# EAGLE schematic WiLoV2 (EAGLE 9.6.2)

## Sheet 1 of 3
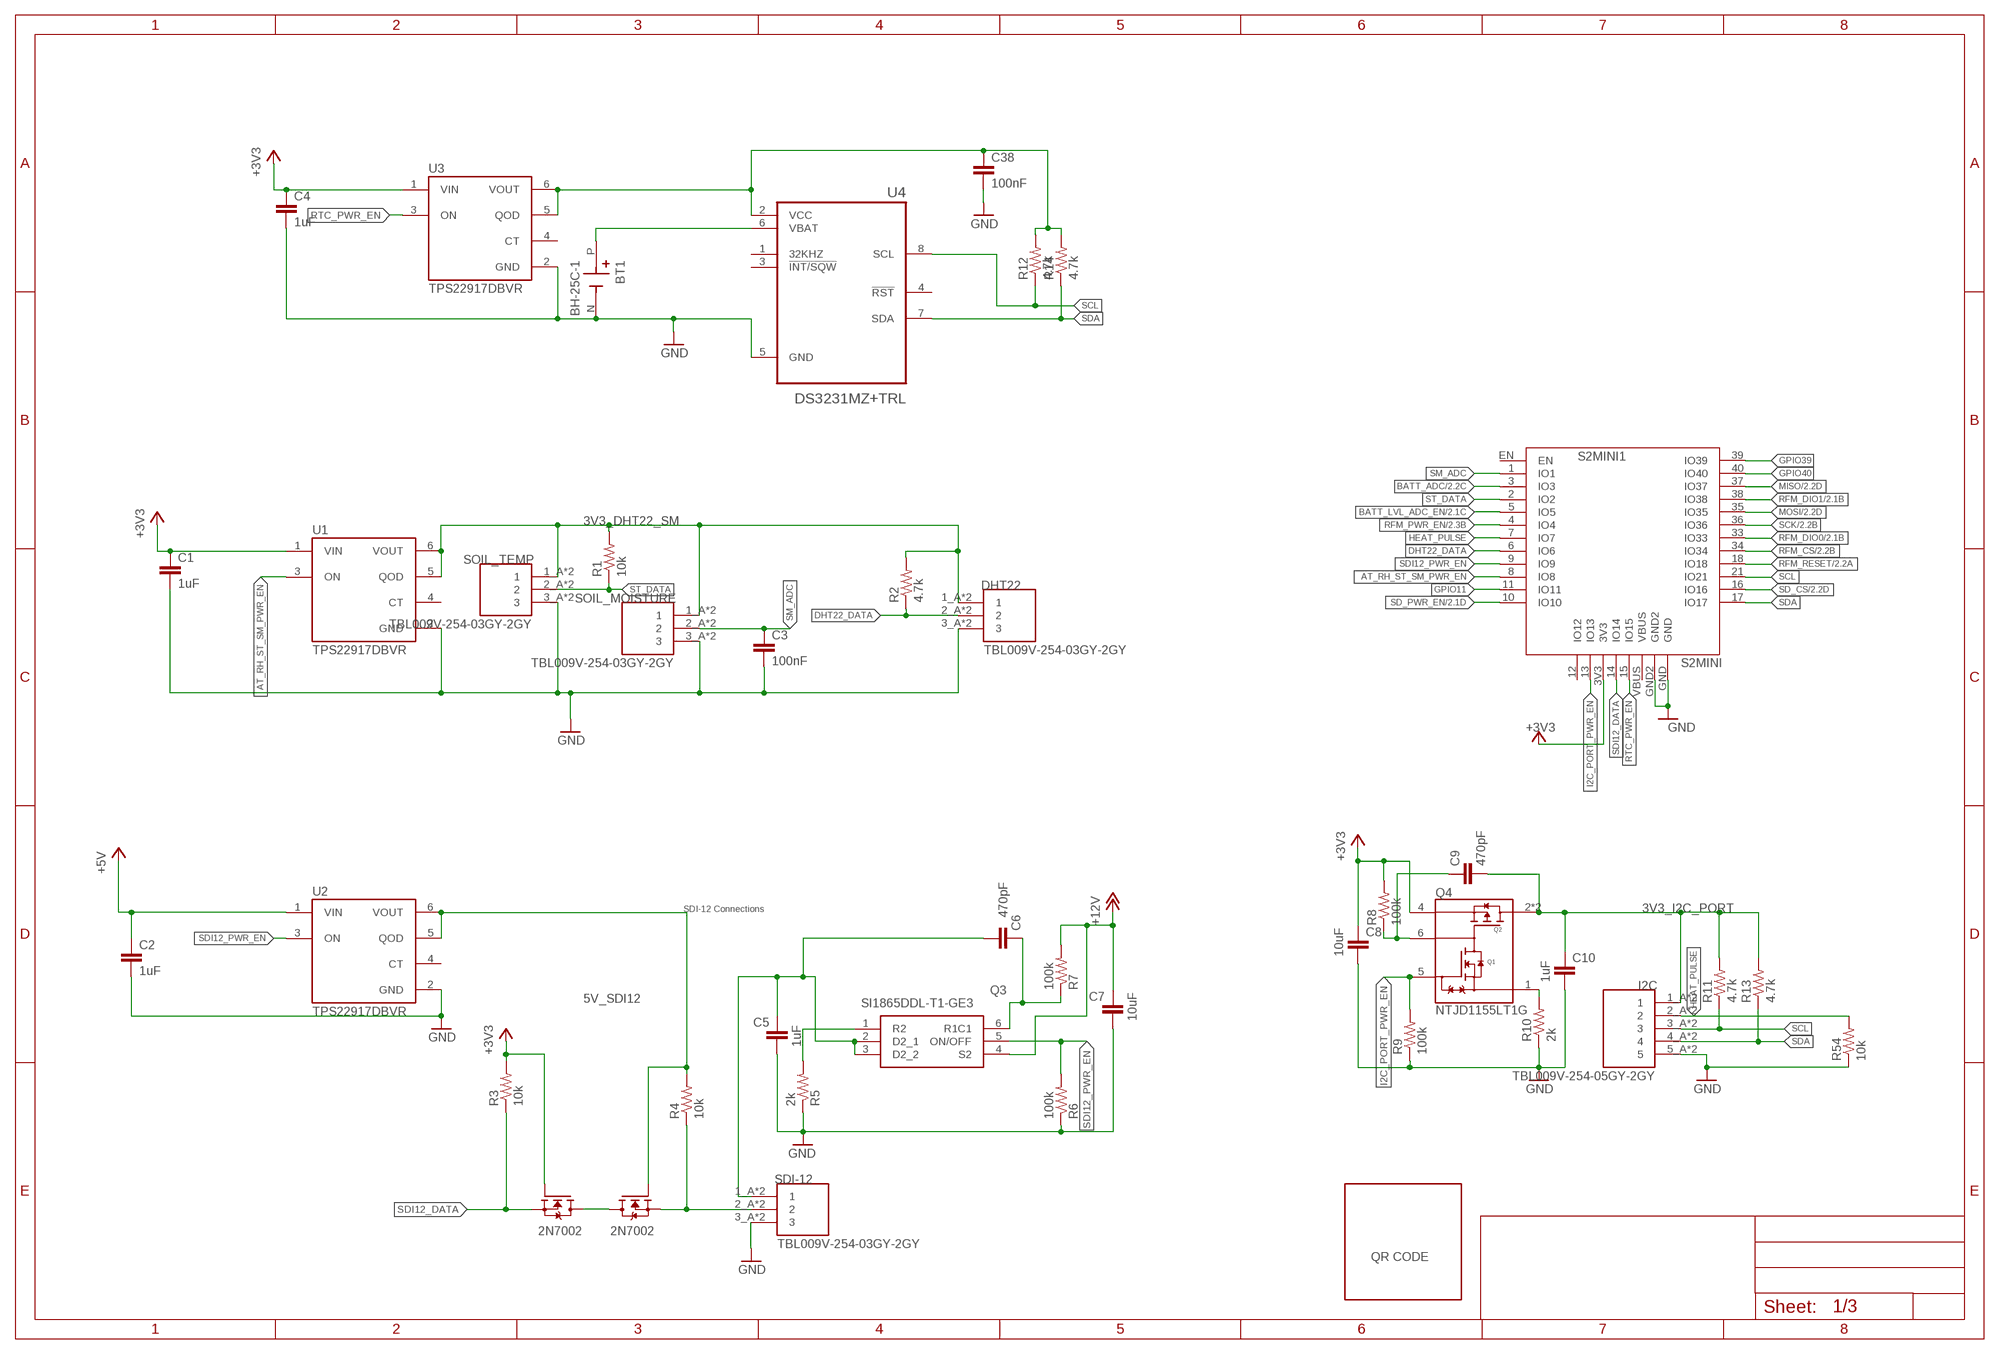
[diagram p0: schematic, sheet 1]

### Parts
BT1  BH-25C-1  [BAT_BH-25C-1]
C1  1uF  C-EUC0805  [C0805]
C2  1uF  C-EUC0805  [C0805]
C3  100nF  C-EUC0805  [C0805]
C4  1uF  C-EUC0805  [C0805]
C5  1uF  C-EUC0805  [C0805]
C6  470pF  C-EUC0805  [C0805]
C7  10uF  C-EUC0805  [C0805]
C8  10uF  C-EUC0805  [C0805]
C9  470pF  C-EUC0805  [C0805]
C10  1uF  C-EUC0805  [C0805]
C38  100nF  C-EUC0805  [C0805]
DHT22  TBL009V-254-03GY-2GY  [CUI_TBL009V-254-03GY-2GY]
I2C  TBL009V-254-05GY-2GY  [CUI_TBL009V-254-05GY-2GY]
Q1  2N7002  [SOT95P240X111-3N]
Q2  2N7002  [SOT95P240X111-3N]
Q3  SI1865DDL-T1-GE3  [SOT65P210X110-6N]
Q4  NTJD1155LT1G  [TRANS_NTJD1155LT1G]
QR_CODE  QR_CODE  [QR_CODE]
R1  10k  R-US_R0603  [R0603]
R2  4.7k  R-US_R0603  [R0603]
R3  10k  R-US_R0603  [R0603]
R4  10k  R-US_R0603  [R0603]
R5  2k  R-US_R0603  [R0603]
R6  100k  R-US_R0603  [R0603]
R7  100k  R-US_R0603  [R0603]
R8  100k  R-US_R0603  [R0603]
R9  100k  R-US_R0603  [R0603]
R10  2k  R-US_R0603  [R0603]
R11  4.7k  R-US_R0603  [R0603]
R12  4.7k  R-US_R0603  [R0603]
R13  4.7k  R-US_R0603  [R0603]
R14  4.7k  R-US_R0603  [R0603]
R54  10k  R-US_R0603  [R0603]
S2MINI1  S2MINI  [S2MINI]
SDI-12  TBL009V-254-03GY-2GY  [CUI_TBL009V-254-03GY-2GY]
SOIL_MOISTURE  TBL009V-254-03GY-2GY  [CUI_TBL009V-254-03GY-2GY]
SOIL_TEMP  TBL009V-254-03GY-2GY  [CUI_TBL009V-254-03GY-2GY]
U1  TPS22917DBVR  [SOT95P280X145-6N]
U2  TPS22917DBVR  [SOT95P280X145-6N]
U3  TPS22917DBVR  [SOT95P280X145-6N]
U4  DS3231MZ+TRL  [SOIC127P600X175-8N]

### Nets
3V3_DHT22_SM: DHT22.1_A DHT22.1_B R1.2 R2.2 SOIL_MOISTURE.1_A SOIL_MOISTURE.1_B SOIL_TEMP.1_A SOIL_TEMP.1_B U1.5(QOD) U1.6(VOUT)
3V3_I2C_PORT: C9.2 C10.1 I2C.1_A I2C.1_B Q4.2(D2) Q4.3(D2) R11.2 R13.2
5V_SDI12: Q2.1(G) R4.2 U2.5(QOD) U2.6(VOUT)
+3V3: C1.1 C4.1 C8.1 Q1.1(G) Q4.4(S2) R3.2 R8.2 S2MINI1.3V3 U1.1(VIN) U3.1(VIN) ; also sheet 2,3
+5V: C2.1 U2.1(VIN) ; also sheet 2
+12V: C7.1 Q3.4(S2) R7.2 ; also sheet 2
AT_RH_ST_SM_PWR_EN [vcc]: S2MINI1.8(IO8) U1.3(ON)
BATT_ADC [vcc]: S2MINI1.3(IO3) ; also sheet 2
BATT_LVL_ADC_EN [vcc]: S2MINI1.5(IO5) ; also sheet 2
DHT22_DATA [vcc]: DHT22.2_A DHT22.2_B R2.1 S2MINI1.6(IO6)
GND: BT1.N C1.2 C2.2 C3.2 C4.2 C5.2 C7.2 C8.2 C10.2 C38.2 DHT22.3_A DHT22.3_B I2C.5_A I2C.5_B R5.1 R6.1 R9.1 R10.1 R54.1 S2MINI1.GND S2MINI1.GND2 SDI-12.3_A SDI-12.3_B SOIL_MOISTURE.3_A SOIL_MOISTURE.3_B SOIL_TEMP.3_A SOIL_TEMP.3_B U1.2(GND) U2.2(GND) U3.2(GND) U4.5(GND) ; also sheet 2,3
GPIO11 [vcc]: S2MINI1.11(IO11)
GPIO39 [vcc]: S2MINI1.39(IO39)
GPIO40: S2MINI1.40(IO40)
HEAT_PULSE: I2C.2_A I2C.2_B R54.2 S2MINI1.7(IO7)
I2C_PORT_PWR_EN [vcc]: Q4.5(G1) R9.2 S2MINI1.13(IO13)
MISO [vcc]: S2MINI1.37(IO37) ; also sheet 2
MOSI [vcc]: S2MINI1.35(IO35) ; also sheet 2
N$1: Q1.3(D) Q2.3(D)
N$2: C6.1 Q3.6(R1C1) R7.1
N$4: Q3.1(R2) R5.2
N$5: C9.1 Q4.6(D1/G2) R8.1
N$7: Q4.1(S1) R10.2
N$8: C5.1 C6.2 Q3.2(D2_1) Q3.3(D2_2) SDI-12.1_A SDI-12.1_B
N$12: BT1.P U4.6(VBAT)
N$14: C38.1 R12.2 R14.2 U3.5(QOD) U3.6(VOUT) U4.2(VCC)
N$24: Q2.2(S) R4.1 SDI-12.2_A SDI-12.2_B
RFM_CS [Impedance]: S2MINI1.34(IO34) ; also sheet 2
RFM_DIO0 [vcc]: S2MINI1.33(IO33) ; also sheet 2
RFM_DIO1: S2MINI1.38(IO38) ; also sheet 2
RFM_PWR_EN [vcc]: S2MINI1.4(IO4) ; also sheet 2
RFM_RESET [vcc]: S2MINI1.18(IO18) ; also sheet 2
RTC_PWR_EN: S2MINI1.15(IO15) U3.3(ON)
SCK [vcc]: S2MINI1.36(IO36) ; also sheet 2
SCL [vcc]: I2C.3_A I2C.3_B R11.1 R12.1 S2MINI1.21(IO21) U4.8(SCL)
SD_CS [vcc]: S2MINI1.16(IO16) ; also sheet 2
SD_PWR_EN [vcc]: S2MINI1.10(IO10) ; also sheet 2
SDA [vcc]: I2C.4_A I2C.4_B R13.1 R14.1 S2MINI1.17(IO17) U4.7(SDA)
SDI12_DATA [vcc]: Q1.2(S) R3.1 S2MINI1.14(IO14)
SDI12_PWR_EN [vcc]: Q3.5(ON/OFF) R6.2 S2MINI1.9(IO9) U2.3(ON)
SM_ADC [vcc]: C3.1 S2MINI1.1(IO1) SOIL_MOISTURE.2_A SOIL_MOISTURE.2_B
ST_DATA [vcc]: R1.1 S2MINI1.2(IO2) SOIL_TEMP.2_A SOIL_TEMP.2_B
Unconnected: S2MINI1.12(IO12) S2MINI1.EN S2MINI1.VBUS U1.4(CT) U2.4(CT) U3.4(CT) U4.1(32KHZ) U4.3(!INT/SQW) U4.4(!RST)

### Notes on the sheet
- SDI-12 Connections

## Sheet 2 of 3
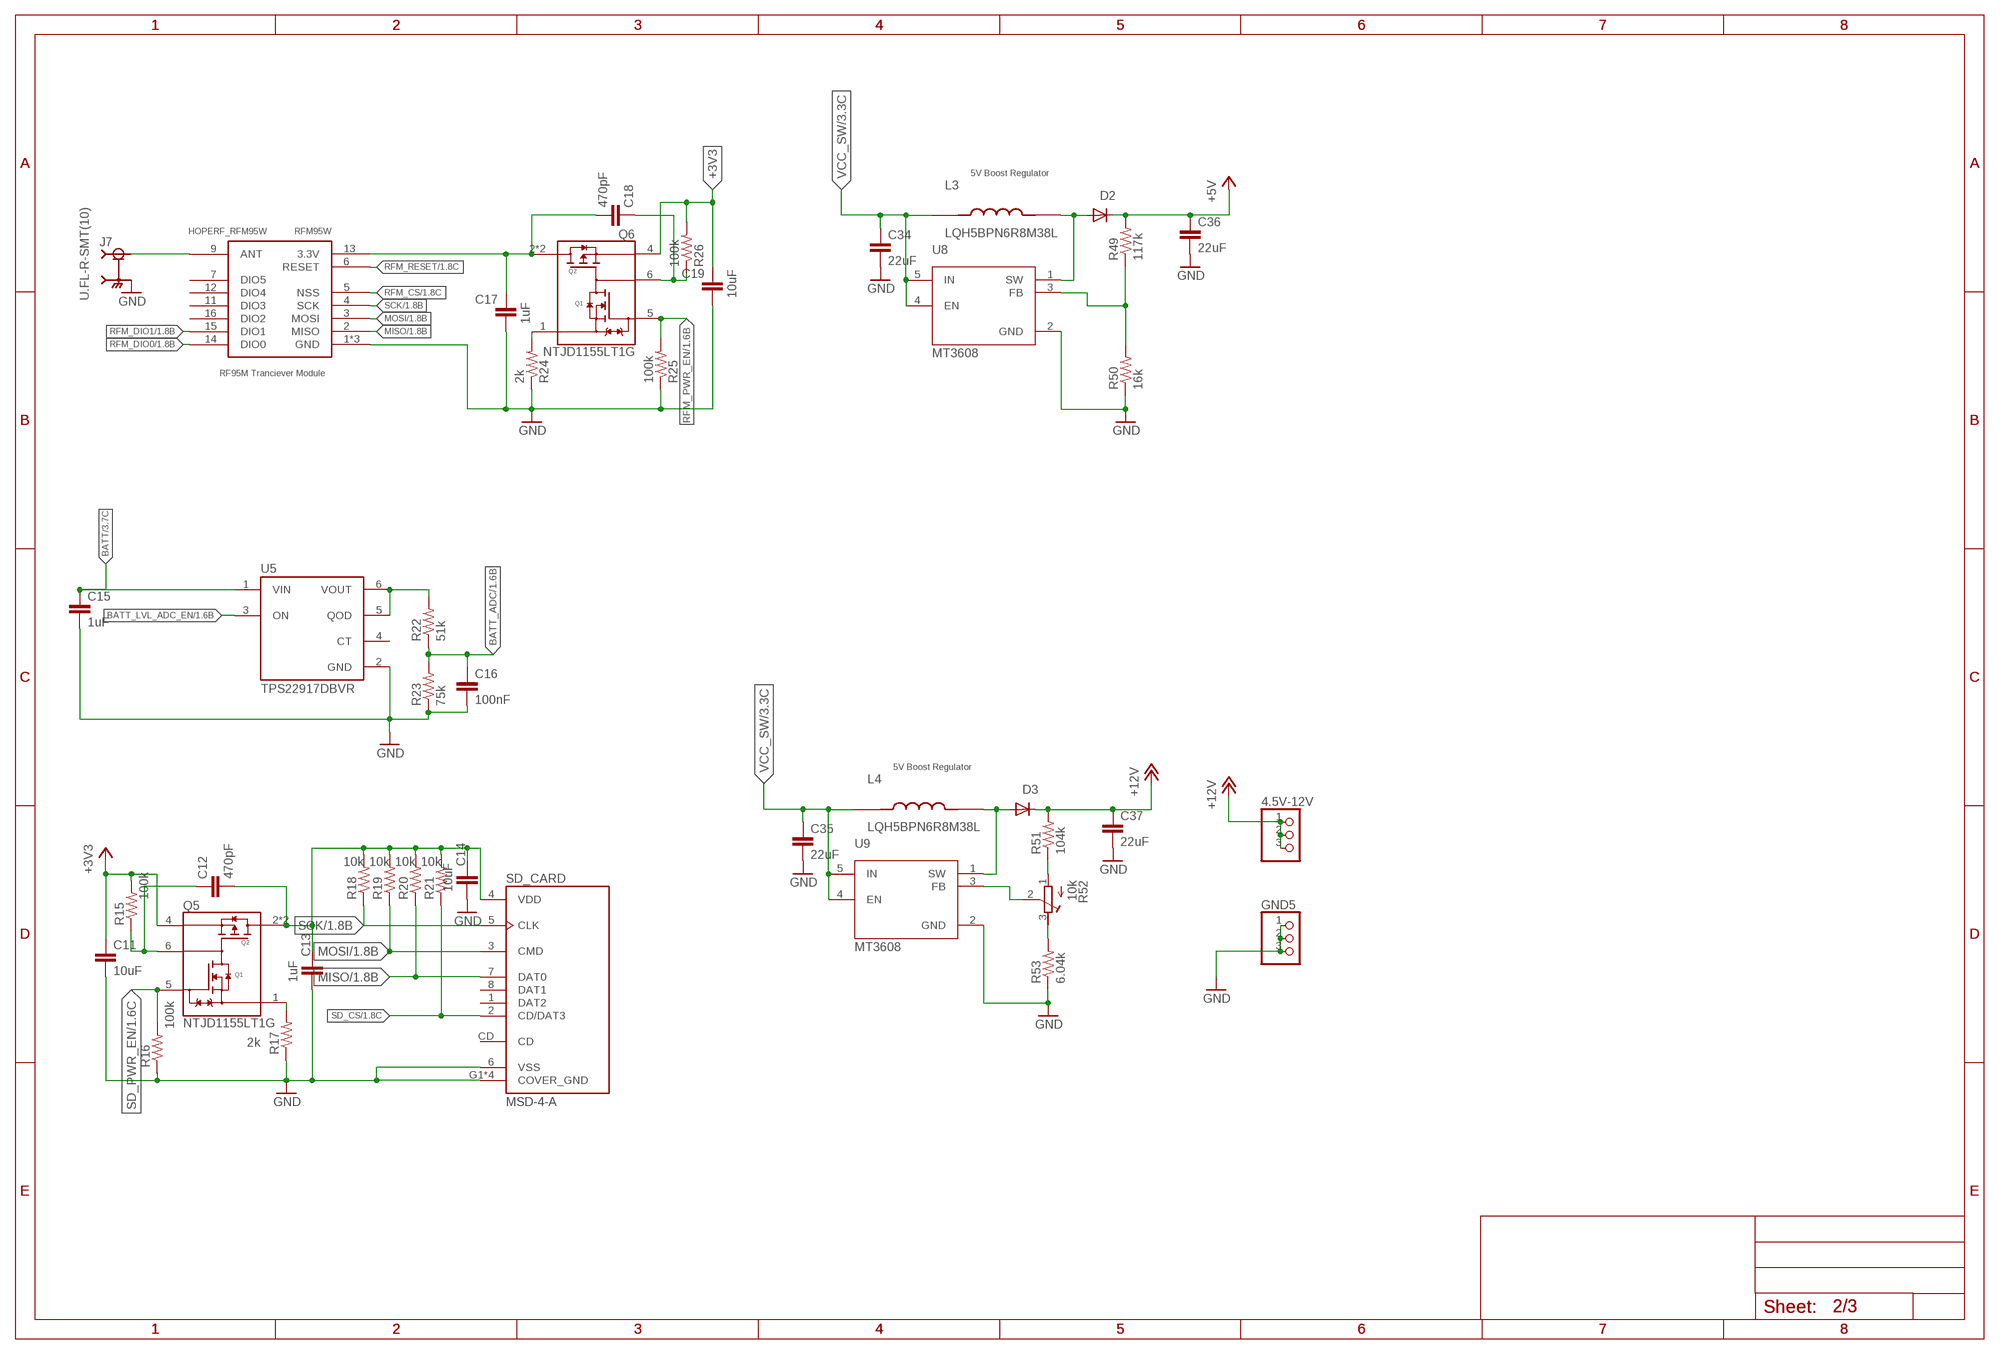
[diagram p1: schematic, sheet 2]

### Parts
4.5V-12V  PINHD-1X3  [1X03]
C11  10uF  C-EUC0805  [C0805]
C12  470pF  C-EUC0805  [C0805]
C13  1uF  C-EUC0805  [C0805]
C14  10uF  C-EUC0805  [C0805]
C15  1uF  C-EUC0805  [C0805]
C16  100nF  C-EUC0805  [C0805]
C17  1uF  C-EUC0805  [C0805]
C18  470pF  C-EUC0805  [C0805]
C19  10uF  C-EUC0805  [C0805]
C34  22uF  C-EUC0805  [C0805]
C35  22uF  C-EUC0805  [C0805]
C36  22uF  C-EUC0805  [C0805]
C37  22uF  C-EUC0805  [C0805]
D2  DIODE_SOD-123FL  [SOD-123FL]
D3  DIODE_SOD-123FL  [SOD-123FL]
GND5  PINHD-1X3  [1X03]
J7  U.FL-R-SMT(10)  [HRS_U.FL-R-SMT(10)]
L3  LQH5BPN6R8M38L  [IND_LQH5BPN6R8M38L]
L4  LQH5BPN6R8M38L  [IND_LQH5BPN6R8M38L]
Q5  NTJD1155LT1G  [TRANS_NTJD1155LT1G]
Q6  NTJD1155LT1G  [TRANS_NTJD1155LT1G]
R15  100k  R-US_R0603  [R0603]
R16  100k  R-US_R0603  [R0603]
R17  2k  R-US_R0603  [R0603]
R18  10k  R-US_R0603  [R0603]
R19  10k  R-US_R0603  [R0603]
R20  10k  R-US_R0603  [R0603]
R21  10k  R-US_R0603  [R0603]
R22  51k  R-US_R0603  [R0603]
R23  75k  R-US_R0603  [R0603]
R24  2k  R-US_R0603  [R0603]
R25  100k  R-US_R0603  [R0603]
R26  100k  R-US_R0603  [R0603]
R49  117k  R-US_R0603  [R0603]
R50  16k  R-US_R0603  [R0603]
R51  104k  R-US_R0603  [R0603]
R52  10k  R-TRIMM3296W  [RTRIM3296W]
R53  6.04k  R-US_R0603  [R0603]
RFM95W  HOPERF_RFM95W  [HOPERF_RFM95W]
SD_CARD  MSD-4-A  [CUI_MSD-4-A]
U5  TPS22917DBVR  [SOT95P280X145-6N]
U8  MT3608  [SOT95P280X145-6N]
U9  MT3608  [SOT95P280X145-6N]

### Nets
+3V3: C11.1 C19.1 Q5.4(S2) Q6.4(S2) R15.2 R26.2 ; also sheet 1,3
+5V: C36.1 D2.C R49.2 ; also sheet 1
+12V: 4.5V-12V.1 4.5V-12V.2 4.5V-12V.3 C37.1 D3.C R51.2 ; also sheet 1
BATT: C15.1 U5.1(VIN) ; also sheet 3
BATT_ADC [vcc]: C16.1 R22.1 R23.2 ; also sheet 1
BATT_LVL_ADC_EN [vcc]: U5.3(ON) ; also sheet 1
GND: C11.2 C13.2 C14.2 C15.2 C16.2 C17.2 C19.2 C34.2 C35.2 C36.2 C37.2 GND5.1 GND5.2 GND5.3 J7.2(GND) J7.3(GND) R16.1 R17.1 R23.1 R24.1 R25.1 R50.1 R53.1 RFM95W.1(GND) RFM95W.8(GND) RFM95W.10(GND) SD_CARD.6(VSS) SD_CARD.G1(COVER_GND) SD_CARD.G2(COVER_GND) SD_CARD.G3(COVER_GND) SD_CARD.G4(COVER_GND) U5.2(GND) U8.2(GND) U9.2(GND) ; also sheet 1,3
MISO [vcc]: R20.1 RFM95W.2(MISO) SD_CARD.7(DAT0) ; also sheet 1
MOSI [vcc]: R19.1 RFM95W.3(MOSI) SD_CARD.3(CMD) ; also sheet 1
N$3: R22.2 U5.5(QOD) U5.6(VOUT)
N$6: R51.1 R52.1(A)
N$9: D3.A L4.2 U9.1(SW)
N$10: R52.2(S) U9.3(FB)
N$11: R52.3(E) R53.2
N$15: C12.1 Q5.6(D1/G2) R15.1
N$17: Q5.1(S1) R17.2
N$18: D2.A L3.2 U8.1(SW)
N$20 [Impedance]: J7.1(SIG) RFM95W.9(ANT)
N$26: R49.1 R50.2 U8.3(FB)
N$27: C12.2 C13.1 C14.1 Q5.2(D2) Q5.3(D2) R18.2 R19.2 R20.2 R21.2 SD_CARD.4(VDD)
N$42: C18.1 Q6.6(D1/G2) R26.1
N$47: Q6.1(S1) R24.2
N$48: C17.1 C18.2 Q6.2(D2) Q6.3(D2) RFM95W.13(3.3V)
RFM_CS [Impedance]: RFM95W.5(NSS) ; also sheet 1
RFM_DIO0 [vcc]: RFM95W.14(DIO0) ; also sheet 1
RFM_DIO1: RFM95W.15(DIO1) ; also sheet 1
RFM_PWR_EN [vcc]: Q6.5(G1) R25.2 ; also sheet 1
RFM_RESET [vcc]: RFM95W.6(RESET) ; also sheet 1
SCK [vcc]: R18.1 RFM95W.4(SCK) SD_CARD.5(CLK) ; also sheet 1
SD_CS [vcc]: R21.1 SD_CARD.2(CD/DAT3) ; also sheet 1
SD_PWR_EN [vcc]: Q5.5(G1) R16.2 ; also sheet 1
VCC_SW: C34.1 C35.1 L3.1 L4.1 U8.4(EN) U8.5(IN) U9.4(EN) U9.5(IN) ; also sheet 3
Unconnected: RFM95W.7(DIO5) RFM95W.11(DIO3) RFM95W.12(DIO4) RFM95W.16(DIO2) SD_CARD.1(DAT2) SD_CARD.8(DAT1) SD_CARD.CD U5.4(CT)

### Notes on the sheet
- 5V Boost Regulator
- RF95M Tranciever Module
- 5V Boost Regulator

## Sheet 3 of 3
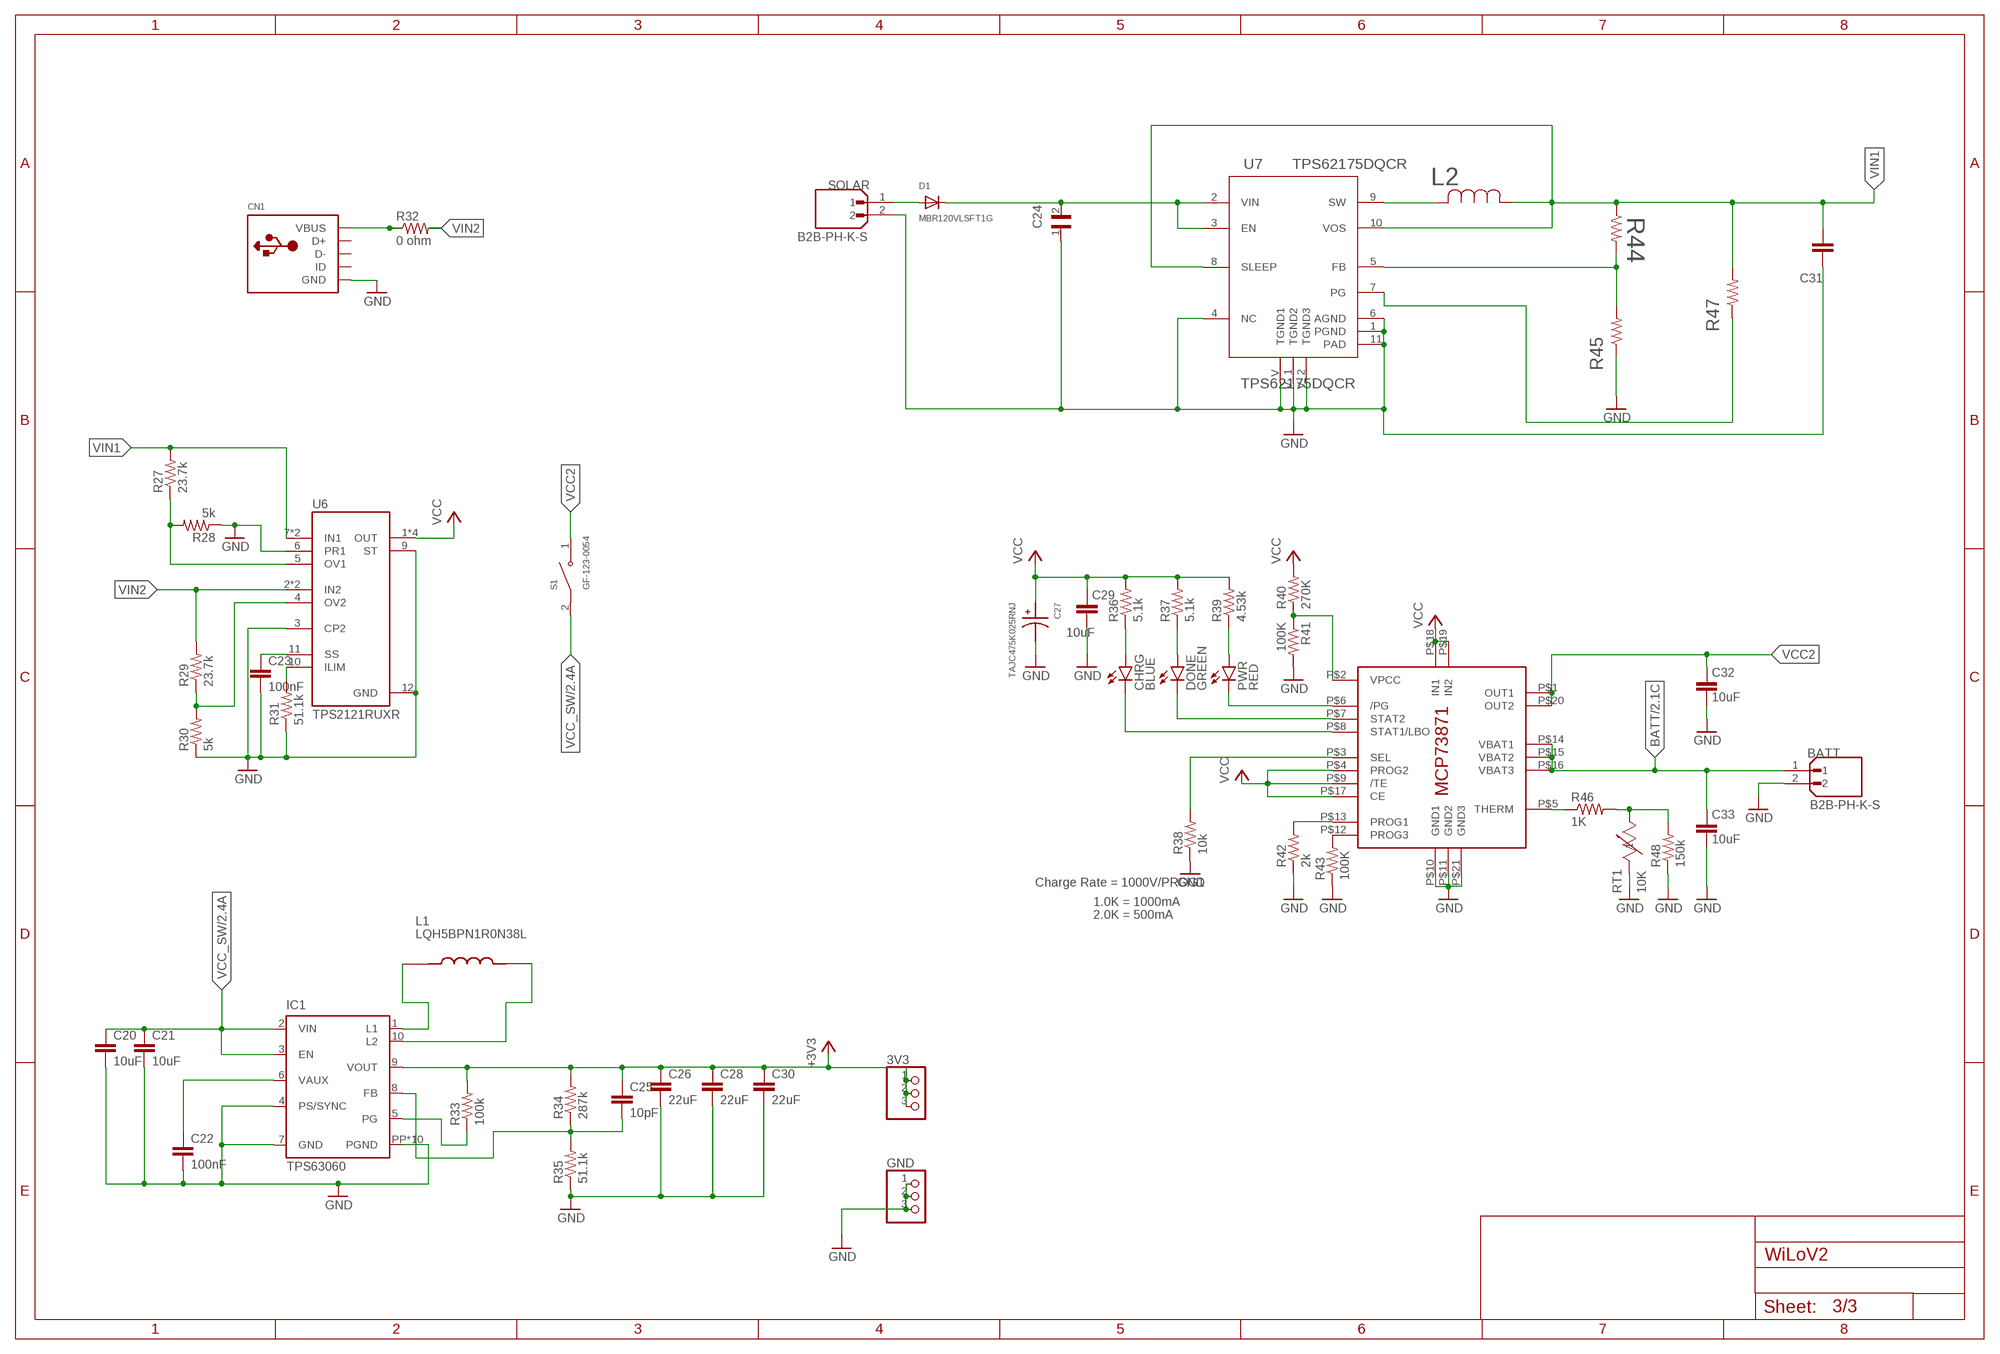
[diagram p2: schematic, sheet 3]

### Parts
3V3  PINHD-1X3  [1X03]
BATT  B2B-PH-K-S  [JST_B2B-PH-K-S]
C20  10uF  C-EUC0805  [C0805]
C21  10uF  C-EUC0805  [C0805]
C22  100nF  C-EUC0805  [C0805]
C23  100nF  C-EUC0805  [C0805]
C24  2.2uF  CGA4J3X7R1H225K125AB  [CAPC2012X145N]
C25  10pF  C-EUC0805  [C0805]
C26  22uF  C-EUC0805  [C0805]
C27  TAJC475K025RNJ  [CAPPM6032X280N]
C28  22uF  C-EUC0805  [C0805]
C29  10uF  C-EUC0805  [C0805]
C30  22uF  C-EUC0805  [C0805]
C31  22uF  C-EUC0805  [C0805]
C32  10uF  C-EUC0805  [C0805]
C33  10uF  C-EUC0805  [C0805]
CHRG  BLUE  LEDSML0603  [SML0603]
CN1  USBMINIB  [USB-MINIB]
D1  MBR120VLSFT1G  DIODE_SOD-123FL  [SOD-123FL]
DONE  GREEN  LEDSML0603  [SML0603]
GND  PINHD-1X3  [1X03]
IC1  TPS63060  [DSC-S-PWSON-N10]
IC2  MCP73871  [QFN20_4MM]
L1  LQH5BPN1R0N38L  [IND_LQH5BPN1R0N38L]
L2  10uH  IFSC1515AHER100M01IND_IFSC_1515AH_VIS-M  [IND_IFSC_1515AH_VIS-M]
PWR  RED  LEDSML0603  [SML0603]
R27  23.7k  R-US_R0603  [R0603]
R28  5k  R-US_R0603  [R0603]
R29  23.7k  R-US_R0603  [R0603]
R30  5k  R-US_R0603  [R0603]
R31  51.1k  R-US_R0603  [R0603]
R32  0 ohm  R-US_R0805  [R0805]
R33  100k  R-US_R0603  [R0603]
R34  287k  R-US_R0603  [R0603]
R35  51.1k  R-US_R0603  [R0603]
R36  5.1k  R-US_R0603  [R0603]
R37  5.1k  R-US_R0603  [R0603]
R38  10k  R-US_R0603  [R0603]
R39  4.53k  R-US_R0603  [R0603]
R40  270K  R-US_R0603  [R0603]
R41  100K  R-US_R0805  [R0805]
R42  2k  R-US_R0603  [R0603]
R43  100K  R-US_R0805  [R0805]
R44  105k  R-US_R0603  [R0603]
R45  20k  R-US_R0603  [R0603]
R46  1K  R-US_R0603  [R0603]
R47  100k  R-US_R0603  [R0603]
R48  150k  R-US_R0603  [R0603]
RT1  10K  103JG1F  [G1_USS]
S1  GF-123-0054  [SW_GF-123-0054]
SOLAR  B2B-PH-K-S  [JST_B2B-PH-K-S]
U6  TPS2121RUXR  [IC_TPS2121RUXR]
U7  TPS62175DQCR  [DQC0010A]

### Nets
+3V3: 3V3.1 3V3.2 3V3.3 C25.1 C26.1 C28.1 C30.1 IC1.9(VOUT) R33.2 R34.2 ; also sheet 1,2
BATT: BATT.1 C33.1 IC2.P$14(VBAT1) IC2.P$15(VBAT2) IC2.P$16(VBAT3) ; also sheet 2
GND: BATT.2 C20.2 C21.2 C22.2 C23.2 C24.1 C26.2 C27.2 C28.2 C29.2 C30.2 C31.1 C32.2 C33.2 CN1.GND GND.1 GND.2 GND.3 IC1.4(PS/SYNC) IC1.7(GND) IC1.PP(PGND) IC1.PP@1(PGND) IC1.PP@2(PGND) IC1.PP@3(PGND) IC1.PP@4(PGND) IC1.PP@5(PGND) IC1.PP@7(PGND) IC1.PP@8(PGND) IC1.PP@9(PGND) IC1.PP@10(PGND) IC2.P$10(GND1) IC2.P$11(GND2) IC2.P$21(GND3) R28.1 R30.1 R31.1 R35.1 R38.1 R41.2 R42.1 R43.1 R45.1 R48.1 RT1.1 SOLAR.2 U6.3(CP2) U6.6(PR1) U6.9(ST) U6.12(GND) U7.1(PGND) U7.4(NC) U7.6(AGND) U7.11(PAD) U7.V(TGND1) U7.V_1(TGND2) U7.V_2(TGND3) ; also sheet 1,2
N$16: IC1.1(L1) L1.1
N$21: IC1.10(L2) L1.2
N$25: C22.1 IC1.6(VAUX)
N$28: IC1.5(PG) R33.1
N$31: IC2.P$6(/PG) PWR.C
N$32: DONE.C IC2.P$7(STAT2)
N$33: CHRG.C IC2.P$8(STAT1/LBO)
N$34: CHRG.A R36.1
N$35: DONE.A R37.1
N$36: PWR.A R39.1
N$37: IC2.P$12(PROG3) R43.2
N$38: IC2.P$13(PROG1) R42.2
N$39: C24.2 D1.C U7.2(VIN) U7.3(EN)
N$40: IC2.P$5(THERM) R46.1
N$41: R46.2 R48.2 RT1.2
N$43: CN1.VBUS R32.1
N$44: C25.2 IC1.8(FB) R34.1 R35.2
N$45: L2.2 U7.9(SW)
N$46: R44.2 R45.2 U7.5(FB)
N$49: R47.1 U7.7(PG)
N$50: R27.1 R28.2 U6.5(OV1)
N$51: R29.1 R30.2 U6.4(OV2)
N$52: R31.2 U6.10(ILIM)
N$53: C23.1 U6.11(SS)
N$54: IC2.P$3(SEL) R38.2
N$55: D1.A SOLAR.1
VCC [vcc]: C27.1 C29.1 IC2.P$4(PROG2) IC2.P$9(/TE) IC2.P$17(CE) IC2.P$18(IN1) IC2.P$19(IN2) R36.2 R37.2 R39.2 R40.2 U6.1(OUT) U6.1_1(OUT) U6.8(OUT) U6.8_1(OUT)
VCC2 [vcc]: C32.1 IC2.P$1(OUT1) IC2.P$20(OUT2) S1.1
VCC_SW: C20.1 C21.1 IC1.2(VIN) IC1.3(EN) S1.2 ; also sheet 2
VIN1: C31.2 L2.1 R27.2 R44.1 R47.2 U6.7(IN1) U6.7_1(IN1) U7.8(SLEEP) U7.10(VOS)
VIN2: R29.2 R32.2 U6.2(IN2) U6.2_1(IN2)
VPCC: IC2.P$2(VPCC) R40.1 R41.1
Unconnected: CN1.D+ CN1.D- CN1.ID

### Notes on the sheet
- Charge Rate = 1000V/PROG1
- 1.0K = 1000mA
- 2.0K = 500mA

## Library data of the parts
3V3 4.5V-12V GND GND5 = adafruit:PINHD-1X3: PIN HEADER; MPN: 61300311121
BATT SOLAR = B2B-PH-K-S:B2B-PH-K-S; MANUFACTURER: JST; MPN: B2B-PH-K-S
BT1 = BH-25C-1:BH-25C-1; MANUFACTURER: Adam Tech; MAXIMUM_PACKAGE_HEIGHT: 8.7mm; MPN: BH-25C-1; STANDARD: Manufacturer Recommendations
C1 C4 C13 C15 C17 = rcl@2:C-EU: CAPACITOR, European symbol; MPN: CC0805KKX7R9BB105; SPICEPREFIX: C
C2 = rcl:C-EU: CAPACITOR, European symbol; MPN: CC0805KKX7R9BB105; SPICEPREFIX: C
C3 = rcl@1:C-EU: CAPACITOR, European symbol; MPN: KGM21NR71E104KT; SPICEPREFIX: C
C5 C10 = rcl@1:C-EU: CAPACITOR, European symbol; MPN: CC0805KKX7R9BB105; SPICEPREFIX: C
C6 C9 = rcl@1:C-EU: CAPACITOR, European symbol; MPN: CC0805JRNPOBBN471; SPICEPREFIX: C
C7 C8 = rcl@1:C-EU: CAPACITOR, European symbol; MPN: GRM21BR61C106KE15K; SPICEPREFIX: C
C11 C14 C19-C21 C29 C32 C33 = rcl@2:C-EU: CAPACITOR, European symbol; MPN: GRM21BR61C106KE15K; SPICEPREFIX: C
C12 C18 = rcl@2:C-EU: CAPACITOR, European symbol; MPN: CC0805JRNPOBBN471; SPICEPREFIX: C
C16 C22 C23 = rcl@2:C-EU: CAPACITOR, European symbol; MPN: KGM21NR71E104KT; SPICEPREFIX: C
C24 = CGA4J3X7R1H225K125AB:CGA4J3X7R1H225K125AB: 2.2 µF ±10% 50V Ceramic Capacitor X7R 0805 (2012 Metric); MPN: CGA4J3X7R1H225K125AB
C25 = rcl@2:C-EU: CAPACITOR, European symbol; MPN: C0805C100JDGACTU; SPICEPREFIX: C
C26 C28 C30 C34-C37 = rcl@2:C-EU: CAPACITOR, European symbol; MPN: CL21A226MOQNNNE; SPICEPREFIX: C
C27 = TAJC475K025RNJ:TAJC475K025RNJ: 47µF Molded Tantalum Capacitors 16V 2312 (6032 Metric) 500mOhm; MANUFACTURER: AVX; MAXIMUM_PACKAGE_HEIGHT: 2.80mm; MPN: TAJC475K025RNJ; PARTREV: N/A; STANDARD: IPC-7351B
C31 = rcl:C-EU: CAPACITOR, European symbol; MPN: CL21A226MOQNNNE; SPICEPREFIX: C
C38 = rcl:C-EU: CAPACITOR, European symbol; MPN: KGM21NR71E104KT; SPICEPREFIX: C
CHRG = led:LED: LED OSRAM: - CHIPLED LG R971, LG N971, LY N971, LG Q971, LY Q971, LO R971, LY R971 LH N974, LH R974 LS Q976, LO Q976, LY Q976 LO Q996 - Hyper CHIPLED LW Q18S LB Q993, LB Q99A, LB R99A - SideLED LS A670, LO A670, LY A670, LG A670, LP A670 LB A673, LV A673, LT A673, LW A673 LH A674 LY A675 LS A676, LA A676, LO A676, LY A676, LW A676 LS A679, LY A679, LG A679 - Hyper Micro SIDELED® LS Y876, LA Y876, LO Y876, LY Y876 LT Y87S - SmartLED LW L88C, LW L88S LB L89C, LB L89S, LG L890 LS L89K, LO L89K, LY L89K LS L896, LA L896, LO L896, LY L896 - TOPLED LS T670, LO T670, LY T670, LG T670, LP T670 LSG T670, LSP T670, LSY T670, LOP T670, LYG T670 LG T671, LOG T671, LSG T671 LB T673, LV T673, LT T673, LW T673 LH T674 LS T676, LA T676, LO T676, LY T676, LB T676, LH T676, LSB T676, LW T676 LB T67C, LV T67C, LT T67C, LS T67K, LO T67K, LY T67K, LW E67C LS E67B, LA E67B, LO E67B, LY E67B, LB E67C, LV E67C, LT E67C LW T67C LS T679, LY T679, LG T679 LS T770, LO T770, LY T770, LG T770, LP T770 LB T773, LV T773, LT T773, LW T773 LH T774 LS E675, LA E675, LY E675, LS T675 LS T776, LA T776, LO T776, LY T776, LB T776 LHGB T686 LT T68C, LB T68C - Hyper Mini TOPLED® LB M676 - Mini TOPLED Santana® LG M470 LS M47K, LO M47K, LY M47K Source: http://www.osram.convergy.de LUXEON: - LUMILED® LXK2-PW12-R00, LXK2-PW12-S00, LXK2-PW14-U00, LXK2-PW14-V00 LXK2-PM12-R00, LXK2-PM12-S00, LXK2-PM14-U00 LXK2-PE12-Q00, LXK2-PE12-R00, LXK2-PE12-S00, LXK2-PE14-T00, LXK2-PE14-U00 LXK2-PB12-K00, LXK2-PB12-L00, LXK2-PB12-M00, LXK2-PB14-N00, LXK2-PB14-P00, LXK2-PB14-Q00 LXK2-PR12-L00, LXK2-PR12-M00, LXK2-PR14-Q00, LXK2-PR14-R00 LXK2-PD12-Q00, LXK2-PD12-R00, LXK2-PD12-S00 LXK2-PH12-R00, LXK2-PH12-S00 LXK2-PL12-P00, LXK2-PL12-Q00, LXK2-PL12-R00 Source: www.luxeon.com KINGBRIGHT: KA-3528ASYC Source: www.kingbright.com; MPN: XZCFBB53W-8VF
CN1 = adafruit:USB: USB Connectors USBMINIB - Surface Mount Female Mini-B USB Connector 4UConnector: 06564 By microbuilder.eu Thru-hole RA Female Mini-B USB Connector 4UConnector: 18732 By ladyada.net; MPN: 690-005-299-043
D1-D3 = adafruit:DIODE: Diode SMADIODE - SMA Surface Mount Package 20V 1A Schottky Diode Digikey: 641-1014-6-ND DO-1N4148 - Through Hole Small Current Diode SOD-123 20V 1 A (.5mV Vf) Schottky Diode - Digikey: MBRX120TPMSCT-ND SOD-323 10V 570mA (.38mV Vf, 3ns) Schottky Diode - Digikey: ZLLS410CT-ND SOD-523 30V 30mA Schottky Diode (RB751S-40TE61) - Digikey: RB751S-40TE61CT-ND SOT23-R/W - SOT23 Package (R = Solder Paste/Reflow Ovens, W = Hand-Soldering) BAT54Film 40V 300mA - Digikey: 497-7162-1-ND; MPN: MBR120VLSFT1G
DHT22 SDI-12 SOIL_MOISTURE SOIL_TEMP = TBL009V-254-03GY-2GY:TBL009V-254-03GY-2GY; MANUFACTURER: CUI; MPN: TBL009V-254-03GY-2GY; STANDARD: Manufacturer Recommendations
DONE = led:LED: LED OSRAM: - CHIPLED LG R971, LG N971, LY N971, LG Q971, LY Q971, LO R971, LY R971 LH N974, LH R974 LS Q976, LO Q976, LY Q976 LO Q996 - Hyper CHIPLED LW Q18S LB Q993, LB Q99A, LB R99A - SideLED LS A670, LO A670, LY A670, LG A670, LP A670 LB A673, LV A673, LT A673, LW A673 LH A674 LY A675 LS A676, LA A676, LO A676, LY A676, LW A676 LS A679, LY A679, LG A679 - Hyper Micro SIDELED® LS Y876, LA Y876, LO Y876, LY Y876 LT Y87S - SmartLED LW L88C, LW L88S LB L89C, LB L89S, LG L890 LS L89K, LO L89K, LY L89K LS L896, LA L896, LO L896, LY L896 - TOPLED LS T670, LO T670, LY T670, LG T670, LP T670 LSG T670, LSP T670, LSY T670, LOP T670, LYG T670 LG T671, LOG T671, LSG T671 LB T673, LV T673, LT T673, LW T673 LH T674 LS T676, LA T676, LO T676, LY T676, LB T676, LH T676, LSB T676, LW T676 LB T67C, LV T67C, LT T67C, LS T67K, LO T67K, LY T67K, LW E67C LS E67B, LA E67B, LO E67B, LY E67B, LB E67C, LV E67C, LT E67C LW T67C LS T679, LY T679, LG T679 LS T770, LO T770, LY T770, LG T770, LP T770 LB T773, LV T773, LT T773, LW T773 LH T774 LS E675, LA E675, LY E675, LS T675 LS T776, LA T776, LO T776, LY T776, LB T776 LHGB T686 LT T68C, LB T68C - Hyper Mini TOPLED® LB M676 - Mini TOPLED Santana® LG M470 LS M47K, LO M47K, LY M47K Source: http://www.osram.convergy.de LUXEON: - LUMILED® LXK2-PW12-R00, LXK2-PW12-S00, LXK2-PW14-U00, LXK2-PW14-V00 LXK2-PM12-R00, LXK2-PM12-S00, LXK2-PM14-U00 LXK2-PE12-Q00, LXK2-PE12-R00, LXK2-PE12-S00, LXK2-PE14-T00, LXK2-PE14-U00 LXK2-PB12-K00, LXK2-PB12-L00, LXK2-PB12-M00, LXK2-PB14-N00, LXK2-PB14-P00, LXK2-PB14-Q00 LXK2-PR12-L00, LXK2-PR12-M00, LXK2-PR14-Q00, LXK2-PR14-R00 LXK2-PD12-Q00, LXK2-PD12-R00, LXK2-PD12-S00 LXK2-PH12-R00, LXK2-PH12-S00 LXK2-PL12-P00, LXK2-PL12-Q00, LXK2-PL12-R00 Source: www.luxeon.com KINGBRIGHT: KA-3528ASYC Source: www.kingbright.com; MPN: XZCDGK53W-8VF
I2C = TBL009V-254-05GY-2GY:TBL009V-254-05GY-2GY; MANUFACTURER: CUI; MPN: TBL009V-254-05GY-2GY; STANDARD: Manufacturer Recommendations
IC1 = texas:TPS6306*: HIGH INPUT VOLTAGE BUCK-BOOST CONVERTER WITH 2A SWITCH CURRENT Source: http://www.ti.com/lit/ds/symlink/tps63060.pdf; MPN: TPS63060DSCR
IC2 = adafruit:MCP73871; MPN: MCP73871T-2CCI/ML
J7 = U.FL-R-SMT_10_:U.FL-R-SMT(10); AVAILABILITY: Unavailable; DESCRIPTION: U.FL Series 50 Ohm Receptacle Male Pins Ultra Small SMT Coaxial Connector; MF: Hirose; MP: U.FL-R-SMT_10_; MPN: U.FL-R-SMT-1(01); PACKAGE: FakePackage u; PRICE: None
L1 = LQH5BPN1R0N38L:LQH5BPN1R0N38L; MANUFACTURER: Murata; MAXIMUM_PACKAGE_HEIGHT: 4.0 mm; MPN: LQH5BPN1R0N38L; PARTREV: N/A; STANDARD: Manufacturer Recommendations
L2 = IFSC1515AH:IFSC1515AHER100M01; COPYRIGHT: Copyright (C) 2025 Ultra Librarian. All rights reserved.; MANUFACTURER_PART_NUMBER: IFSC1515AHER100M01; MFR_NAME: Vishay; MPN: IFSC1515AHER100M01
L3 L4 = LQH5BPN6R8M38L:LQH5BPN6R8M38L; MANUFACTURER: Murata; MAXIMUM_PACKAGE_HEIGHT: 4.0 mm; MPN: LQH5BPN6R8M38L; PARTREV: N/A; STANDARD: Manufacturer Recommendations
PWR = led:LED: LED OSRAM: - CHIPLED LG R971, LG N971, LY N971, LG Q971, LY Q971, LO R971, LY R971 LH N974, LH R974 LS Q976, LO Q976, LY Q976 LO Q996 - Hyper CHIPLED LW Q18S LB Q993, LB Q99A, LB R99A - SideLED LS A670, LO A670, LY A670, LG A670, LP A670 LB A673, LV A673, LT A673, LW A673 LH A674 LY A675 LS A676, LA A676, LO A676, LY A676, LW A676 LS A679, LY A679, LG A679 - Hyper Micro SIDELED® LS Y876, LA Y876, LO Y876, LY Y876 LT Y87S - SmartLED LW L88C, LW L88S LB L89C, LB L89S, LG L890 LS L89K, LO L89K, LY L89K LS L896, LA L896, LO L896, LY L896 - TOPLED LS T670, LO T670, LY T670, LG T670, LP T670 LSG T670, LSP T670, LSY T670, LOP T670, LYG T670 LG T671, LOG T671, LSG T671 LB T673, LV T673, LT T673, LW T673 LH T674 LS T676, LA T676, LO T676, LY T676, LB T676, LH T676, LSB T676, LW T676 LB T67C, LV T67C, LT T67C, LS T67K, LO T67K, LY T67K, LW E67C LS E67B, LA E67B, LO E67B, LY E67B, LB E67C, LV E67C, LT E67C LW T67C LS T679, LY T679, LG T679 LS T770, LO T770, LY T770, LG T770, LP T770 LB T773, LV T773, LT T773, LW T773 LH T774 LS E675, LA E675, LY E675, LS T675 LS T776, LA T776, LO T776, LY T776, LB T776 LHGB T686 LT T68C, LB T68C - Hyper Mini TOPLED® LB M676 - Mini TOPLED Santana® LG M470 LS M47K, LO M47K, LY M47K Source: http://www.osram.convergy.de LUXEON: - LUMILED® LXK2-PW12-R00, LXK2-PW12-S00, LXK2-PW14-U00, LXK2-PW14-V00 LXK2-PM12-R00, LXK2-PM12-S00, LXK2-PM14-U00 LXK2-PE12-Q00, LXK2-PE12-R00, LXK2-PE12-S00, LXK2-PE14-T00, LXK2-PE14-U00 LXK2-PB12-K00, LXK2-PB12-L00, LXK2-PB12-M00, LXK2-PB14-N00, LXK2-PB14-P00, LXK2-PB14-Q00 LXK2-PR12-L00, LXK2-PR12-M00, LXK2-PR14-Q00, LXK2-PR14-R00 LXK2-PD12-Q00, LXK2-PD12-R00, LXK2-PD12-S00 LXK2-PH12-R00, LXK2-PH12-S00 LXK2-PL12-P00, LXK2-PL12-Q00, LXK2-PL12-R00 Source: www.luxeon.com KINGBRIGHT: KA-3528ASYC Source: www.kingbright.com; MPN: XZCM2CRK53WA-8VF
Q1 Q2 = 2N7002:2N7002: N-Channel 60V 280mA (Ta) 350mW (Ta) Surface Mount SOT-23-3 (TO-236) Check availability <https://pricing.snapeda.com/parts/2N7002/ON%20Semiconductor/view-part?ref=eda>; AVAILABILITY: In Stock; CHECK_PRICES: https://www.snapeda.com/parts/2N7002/Onsemi/view-part/?ref=eda; DESCRIPTION: Mosfet Array 2 N-Channel (Dual) 60V 280mA 250mW Surface Mount SOT-563F; MF: ON Semiconductor; MP: 2N7002; MPN: 2N7002; PACKAGE: SOT-23-3 ON Semiconductor; PRICE: None; SNAPEDA_LINK: https://www.snapeda.com/parts/2N7002/Onsemi/view-part/?ref=snap
Q3 = SI1865DDL-T1-GE3:SI1865DDL-T1-GE3: VISHAY - SI1865DDL-T1-GE3 - LOAD SWITCH, HIGH SIDE, 12V, SC-70-6 Source: Datasheet <https://componentsearchengine.com/Datasheets/2/SI1865DDL-T1-GE3.pdf>; DESCRIPTION: VISHAY - SI1865DDL-T1-GE3 - LOAD SWITCH, HIGH SIDE, 12V, SC-70-6; HEIGHT: 1.1mm; MANUFACTURER_NAME: Vishay; MANUFACTURER_PART_NUMBER: SI1865DDL-T1-GE3; MOUSER_PART_NUMBER: 78-SI1865DDL-T1-GE3; MOUSER_PRICE-STOCK: https://www.mouser.co.uk/ProductDetail/Vishay-Semiconductors/SI1865DDL-T1-GE3?qs=XynAqUfUlD06GSEfn4KgAA%3D%3D; MPN: SI1865DDL-T1-GE3
Q4-Q6 = NTJD1155LT1G:NTJD1155LT1G: Mosfet Array N and P-Channel 8V 1.3A 400mW Surface Mount SC-88/SC70-6/SOT-363 Check availability <https://pricing.snapeda.com/parts/NTJD1155LT1G/ON%20Semiconductor/view-part?ref=eda>; AVAILABILITY: In Stock; CHECK_PRICES: https://www.snapeda.com/parts/NTJD1155LT1G/Onsemi/view-part/?ref=eda; DESCRIPTION: Mosfet Array N and P-Channel 8V 1.3A 400mW Surface Mount SC-88/SC70-6/SOT-363; MF: ON Semiconductor; MP: NTJD1155LT1G; MPN: NTJD1155LT1G; PACKAGE: SC-88-6 ON Semiconductor; PRICE: None; SNAPEDA_LINK: https://www.snapeda.com/parts/NTJD1155LT1G/Onsemi/view-part/?ref=snap
QR_CODE = QR:QR_CODE
R1 R3 R4 R54 = rcl:R-US_: RESISTOR, American symbol; MPN: ERJ-U03F1002V; SPICEPREFIX: R
R2 R11-R14 = rcl:R-US_: RESISTOR, American symbol; MPN: RK73G1JTTD4701C; SPICEPREFIX: R
R5 R10 R17 R24 = rcl:R-US_: RESISTOR, American symbol; MPN: RC0603FR-072KL; SPICEPREFIX: R
R6-R9 R25 R26 = rcl:R-US_: RESISTOR, American symbol; MPN: CRG0603F100K; SPICEPREFIX: R
R15 R16 R33 R47 = rcl@2:R-US_: RESISTOR, American symbol; MPN: CRG0603F100K; SPICEPREFIX: R
R18-R21 R38 = rcl@2:R-US_: RESISTOR, American symbol; MPN: ERJ-U03F1002V; SPICEPREFIX: R
R22 = rcl:R-US_: RESISTOR, American symbol; MPN: RC0603FR-0751KL; SPICEPREFIX: R
R23 = rcl:R-US_: RESISTOR, American symbol; MPN: AC0603FR-0775KL; SPICEPREFIX: R
R27 R29 = rcl@2:R-US_: RESISTOR, American symbol; MPN: ERJ-3EKF2372V; SPICEPREFIX: R
R28 R30 = rcl@2:R-US_: RESISTOR, American symbol; MPN: RN73A1J5K0FTD; SPICEPREFIX: R
R31 = adafruit:R-US_: RESISTOR, American symbol; MPN: RC0603FR-0751K1L
R32 = adafruit:R-US_: RESISTOR, American symbol; MPN: ERJ-6GEY0R00V
R34 = rcl:R-US_: RESISTOR, American symbol; MPN: ERJ-3EKF2873V; SPICEPREFIX: R
R35 = rcl:R-US_: RESISTOR, American symbol; MPN: RC0603FR-0751K1L; SPICEPREFIX: R
R36 R37 = rcl@2:R-US_: RESISTOR, American symbol; MPN: ERA-3ARW512V; SPICEPREFIX: R
R39 = rcl@2:R-US_: RESISTOR, American symbol; MPN: ERJ-3EKF4531V; SPICEPREFIX: R
R40 = rcl@2:R-US_: RESISTOR, American symbol; MPN: ERJ-3EKF2703V; SPICEPREFIX: R
R41 R43 = adafruit:R-US_: RESISTOR, American symbol; MPN: RC0805FR-07100KL
R42 = rcl@2:R-US_: RESISTOR, American symbol; MPN: RC0603FR-072KL; SPICEPREFIX: R
R44 = rcl@2:R-US_: RESISTOR, American symbol; MPN: AC0603FR-07105KL; SPICEPREFIX: R
R45 = rcl@2:R-US_: RESISTOR, American symbol; MPN: RC0603FR-0720KL; SPICEPREFIX: R
R46 = rcl@2:R-US_: RESISTOR, American symbol; MPN: RMCF0603FT1K00; SPICEPREFIX: R
R48 = rcl@2:R-US_: RESISTOR, American symbol; MPN: ERJ-3EKF1503V; SPICEPREFIX: R
R49 = rcl:R-US_: RESISTOR, American symbol; MPN: RT0603DRE07117KL; SPICEPREFIX: R
R50 = rcl:R-US_: RESISTOR, American symbol; MPN: RC0603FR-0716KL; SPICEPREFIX: R
R51 = rcl:R-US_: RESISTOR, American symbol; MPN: RN73H1JTTD1043B50; SPICEPREFIX: R
R52 = rcl@2:R-TRIMM: Trimm resistor; MPN: 3296W-1-103RLF; SPICEMODEL: X; SPICEPREFIXL: POT
R53 = rcl:R-US_: RESISTOR, American symbol; MPN: ERJ-3EKF6041V; SPICEPREFIX: R
RFM95W = lora-lorawan-modules:HOPERF_RFM95W: HopeRF LoRaWAN modules Link: http://www.hoperf.com/rf_transceiver/lora/; HEIGHT: 1.8; LENGTH: 16; MPN: RFM95W-868S2; WIDTH: 16
RT1 = 103JG1F:103JG1F; COPYRIGHT: Copyright (C) 2025 Ultra Librarian. All rights reserved.; MANUFACTURER_PART_NUMBER: 103JG1F; MFR_NAME: US Sensor; MPN: 103JG1F
S1 = GF-123-0054:GF-123-0054: Slide Switch SPST Through Hole; MANUFACTURER: CW Industries; MAXIMUM_PACKAGE_HIEGHT: 14.96 mm; MPN: GF-123-0054; PARTREV: May 20, 2003; STANDARD: Manufacturer Recommendations
S2MINI1 = S2MINI:S2MINI
SD_CARD = MSD-4-A:MSD-4-A; MANUFACTURER: CUI Devices; MAXIMUM_PACKAGE_HEIGHT: 2.00mm; MPN: MSD-4-A; PARTREV: 1.0; STANDARD: Manufacturer Recommendations
U1-U3 U5 = TPS22917DBVR:TPS22917DBVR; MANUFACTURER: Texas Instruments; MAXIMUM_PACKAGE_HEIGHT: 1.45mm; MPN: TPS22917DBVT; PARTREV: B; STANDARD: IPC 7351B
U4 = DS3231MZ_TRL:DS3231MZ+TRL; MPN: DS3231MZ+TRL
U6 = TPS2121RUXR:TPS2121RUXR: PWR MGMT BATTERY MGMT; MANUFACTURER: TEXAS INSTRUMENTS; MPN: TPS2121RUXR; STANDARD: Manufacturer Recommendations
U7 = TPS62175DQCR:TPS62175DQCR; COPYRIGHT: Copyright (C) 2025 Ultra Librarian. All rights reserved.; MANUFACTURER_PART_NUMBER: TPS62175DQCR; MFR_NAME: Texas Instruments; MPN: TPS62175DQCR; REFDES: RefDes; TYPE: TYPE
U8 U9 = MT3608:MT3608: High Efficiency 1.2MHz 2A Step Up Converter Check availability <https://pricing.snapeda.com/parts/MT3608/Aerosemi%20Technology%20Co.%2C%20Ltd/view-part?ref=eda>; AVAILABILITY: Not in stock; CHECK_PRICES: https://www.snapeda.com/parts/MT3608/Aerosemi+Technology+Co.%252C+Ltd/view-part/?ref=eda; DESCRIPTION: High Efficiency 1.2MHz 2A Step Up Converter; MF: Aerosemi Technology Co., Ltd; MP: MT3608; MPN: MT3608; PACKAGE: Package; PRICE: None; SNAPEDA_LINK: https://www.snapeda.com/parts/MT3608/Aerosemi+Technology+Co.%252C+Ltd/view-part/?ref=snap

## Net classes
0 default: width 0.203 mm
1 vcc: width 0.254 mm
2 Impedance: clearance 0.254 mm